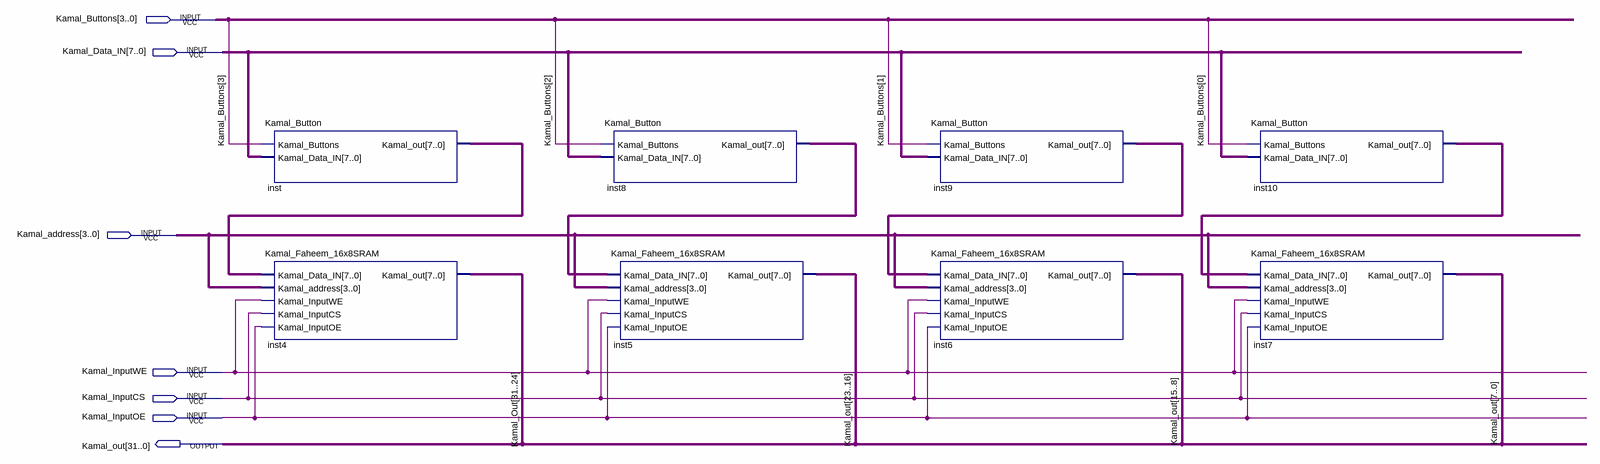
[diagram p0: schematic sheet]
// Quartus schematic Kamal_Faheem_32x16SRAM.bdf as structural Verilog: 8 symbols, 7 pins
module Kamal_Faheem_32x16SRAM (
  input  [3:0] Kamal_Buttons,
  input  [7:0] Kamal_Data_IN,
  input  [3:0] Kamal_address,
  input  Kamal_InputWE,
  input  Kamal_InputCS,
  input  Kamal_InputOE,
  output [31:0] Kamal_out
);

  wire [7:0] inst8_kamal_out, inst9_kamal_out, inst10_kamal_out, inst_kamal_out;

  Kamal_Button inst (.Kamal_Buttons(Kamal_Buttons[3]), .Kamal_Data_IN(Kamal_Data_IN), .Kamal_out(inst_kamal_out));
  Kamal_Faheem_16x8SRAM inst4 (
    .Kamal_Data_IN(inst_kamal_out), .Kamal_address(Kamal_address), .Kamal_InputWE(Kamal_InputWE),
    .Kamal_InputCS(Kamal_InputCS), .Kamal_InputOE(Kamal_InputOE), .Kamal_out(Kamal_out[31:24]));
  Kamal_Button inst8 (.Kamal_Buttons(Kamal_Buttons[2]), .Kamal_Data_IN(Kamal_Data_IN), .Kamal_out(inst8_kamal_out));
  Kamal_Faheem_16x8SRAM inst5 (
    .Kamal_Data_IN(inst8_kamal_out), .Kamal_address(Kamal_address), .Kamal_InputWE(Kamal_InputWE),
    .Kamal_InputCS(Kamal_InputCS), .Kamal_InputOE(Kamal_InputOE), .Kamal_out(Kamal_out[23:16]));
  Kamal_Button inst9 (.Kamal_Buttons(Kamal_Buttons[1]), .Kamal_Data_IN(Kamal_Data_IN), .Kamal_out(inst9_kamal_out));
  Kamal_Faheem_16x8SRAM inst6 (
    .Kamal_Data_IN(inst9_kamal_out), .Kamal_address(Kamal_address), .Kamal_InputWE(Kamal_InputWE),
    .Kamal_InputCS(Kamal_InputCS), .Kamal_InputOE(Kamal_InputOE), .Kamal_out(Kamal_out[15:8]));
  Kamal_Button inst10 (.Kamal_Buttons(Kamal_Buttons[0]), .Kamal_Data_IN(Kamal_Data_IN), .Kamal_out(inst10_kamal_out));
  Kamal_Faheem_16x8SRAM inst7 (
    .Kamal_Data_IN(inst10_kamal_out), .Kamal_address(Kamal_address), .Kamal_InputWE(Kamal_InputWE),
    .Kamal_InputCS(Kamal_InputCS), .Kamal_InputOE(Kamal_InputOE), .Kamal_out(Kamal_out[7:0]));
endmodule
